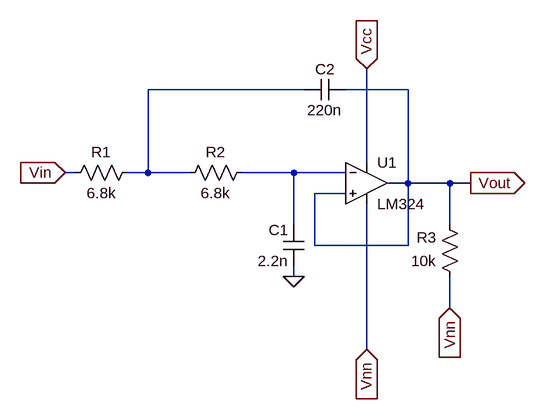
[diagram p0: schematic SallenKeyFilter.asc]
SallenKeyFilter.asc, the LTspice schematic file:
Version 4.1
SHEET 1 880 680
WIRE 112 -32 -128 -32
WIRE 272 -32 176 -32
WIRE 208 80 208 -64
WIRE -240 96 -256 96
WIRE -128 96 -128 -32
WIRE -128 96 -160 96
WIRE -64 96 -128 96
WIRE 96 96 16 96
WIRE 176 96 96 96
WIRE 272 112 272 -32
WIRE 272 112 240 112
WIRE 336 112 272 112
WIRE 368 112 336 112
WIRE 176 128 128 128
WIRE 96 176 96 96
WIRE 336 176 336 112
WIRE 128 208 128 128
WIRE 272 208 272 112
WIRE 272 208 128 208
WIRE 96 256 96 240
WIRE 336 304 336 256
WIRE 208 368 208 144
FLAG 96 256 0
FLAG -256 96 Vin
IOPIN -256 96 In
FLAG 368 112 Vout
IOPIN 368 112 Out
FLAG 336 304 Vnn
IOPIN 336 304 In
FLAG 208 368 Vnn
IOPIN 208 368 In
FLAG 208 -64 Vcc
IOPIN 208 -64 In
SYMBOL LM324 208 112 R0
SYMATTR InstName U1
SYMBOL res -144 80 R90
WINDOW 0 0 56 VBottom 2
WINDOW 3 32 56 VTop 2
SYMATTR InstName R1
SYMATTR Value 6.8k
SYMBOL res 32 80 R90
WINDOW 0 0 56 VBottom 2
WINDOW 3 32 56 VTop 2
SYMATTR InstName R2
SYMATTR Value 6.8k
SYMBOL res 352 272 R180
WINDOW 0 36 76 Left 2
WINDOW 3 36 40 Left 2
SYMATTR InstName R3
SYMATTR Value 10k
SYMBOL cap 112 240 R180
WINDOW 0 24 56 Left 2
WINDOW 3 24 8 Left 2
SYMATTR InstName C1
SYMATTR Value 2.2n
SYMBOL cap 176 -48 R90
WINDOW 0 0 32 VBottom 2
WINDOW 3 32 32 VTop 2
SYMATTR InstName C2
SYMATTR Value 220n

The netlist it stands for:
* SallenKeyFilter.asc
* U1: LM324 (symbol LM324 not available, pins judged from their places): In+=Vout In-=N002 V+=Vcc V-=Vnn OUT=Vout
R1 N001 Vin 6.8k
R2 N002 N001 6.8k
R3 Vnn Vout 10k
C1 0 N002 2.2n
C2 Vout N001 220n
.backanno
.end